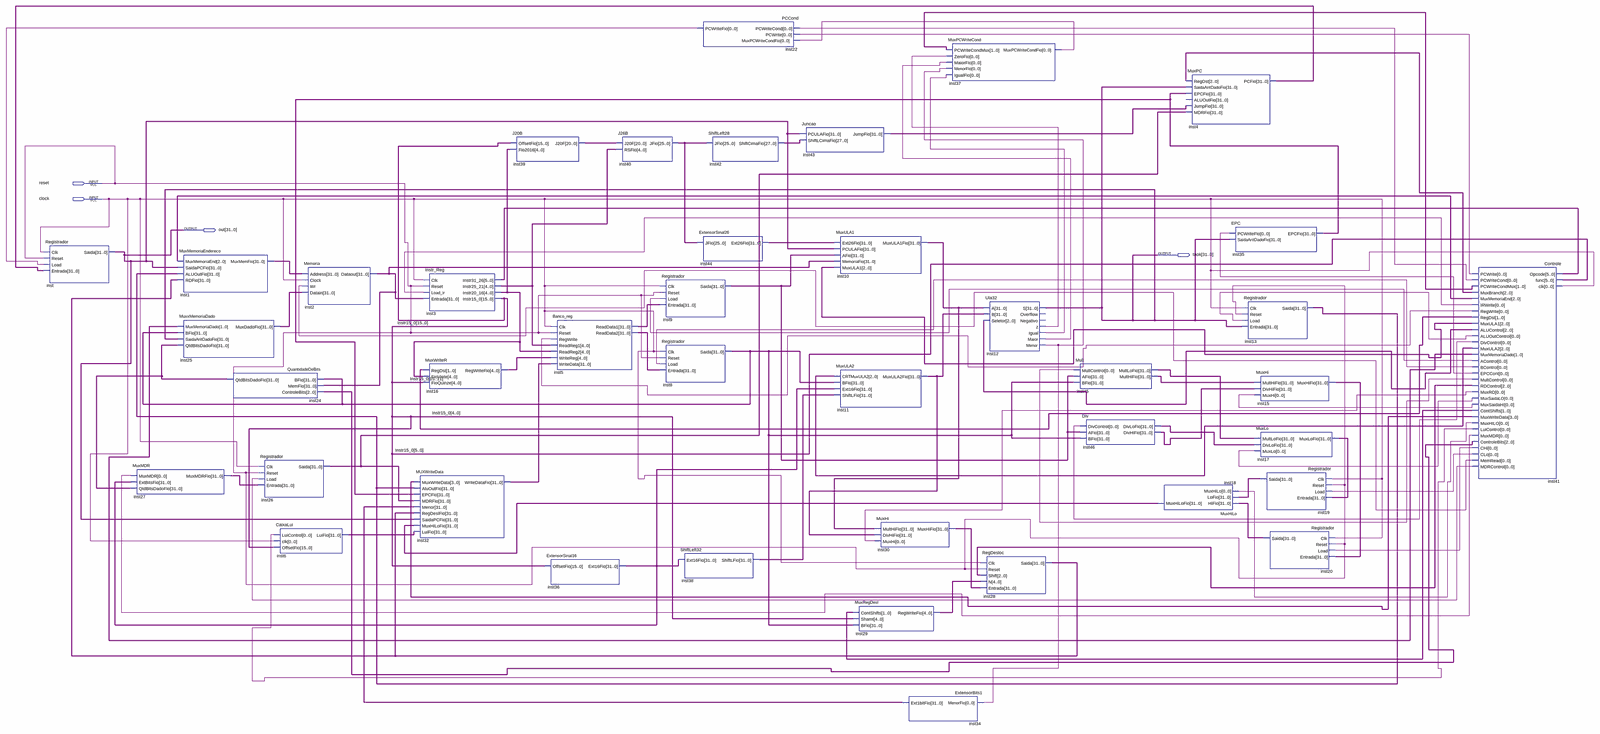
[diagram p0: schematic sheet, whole]
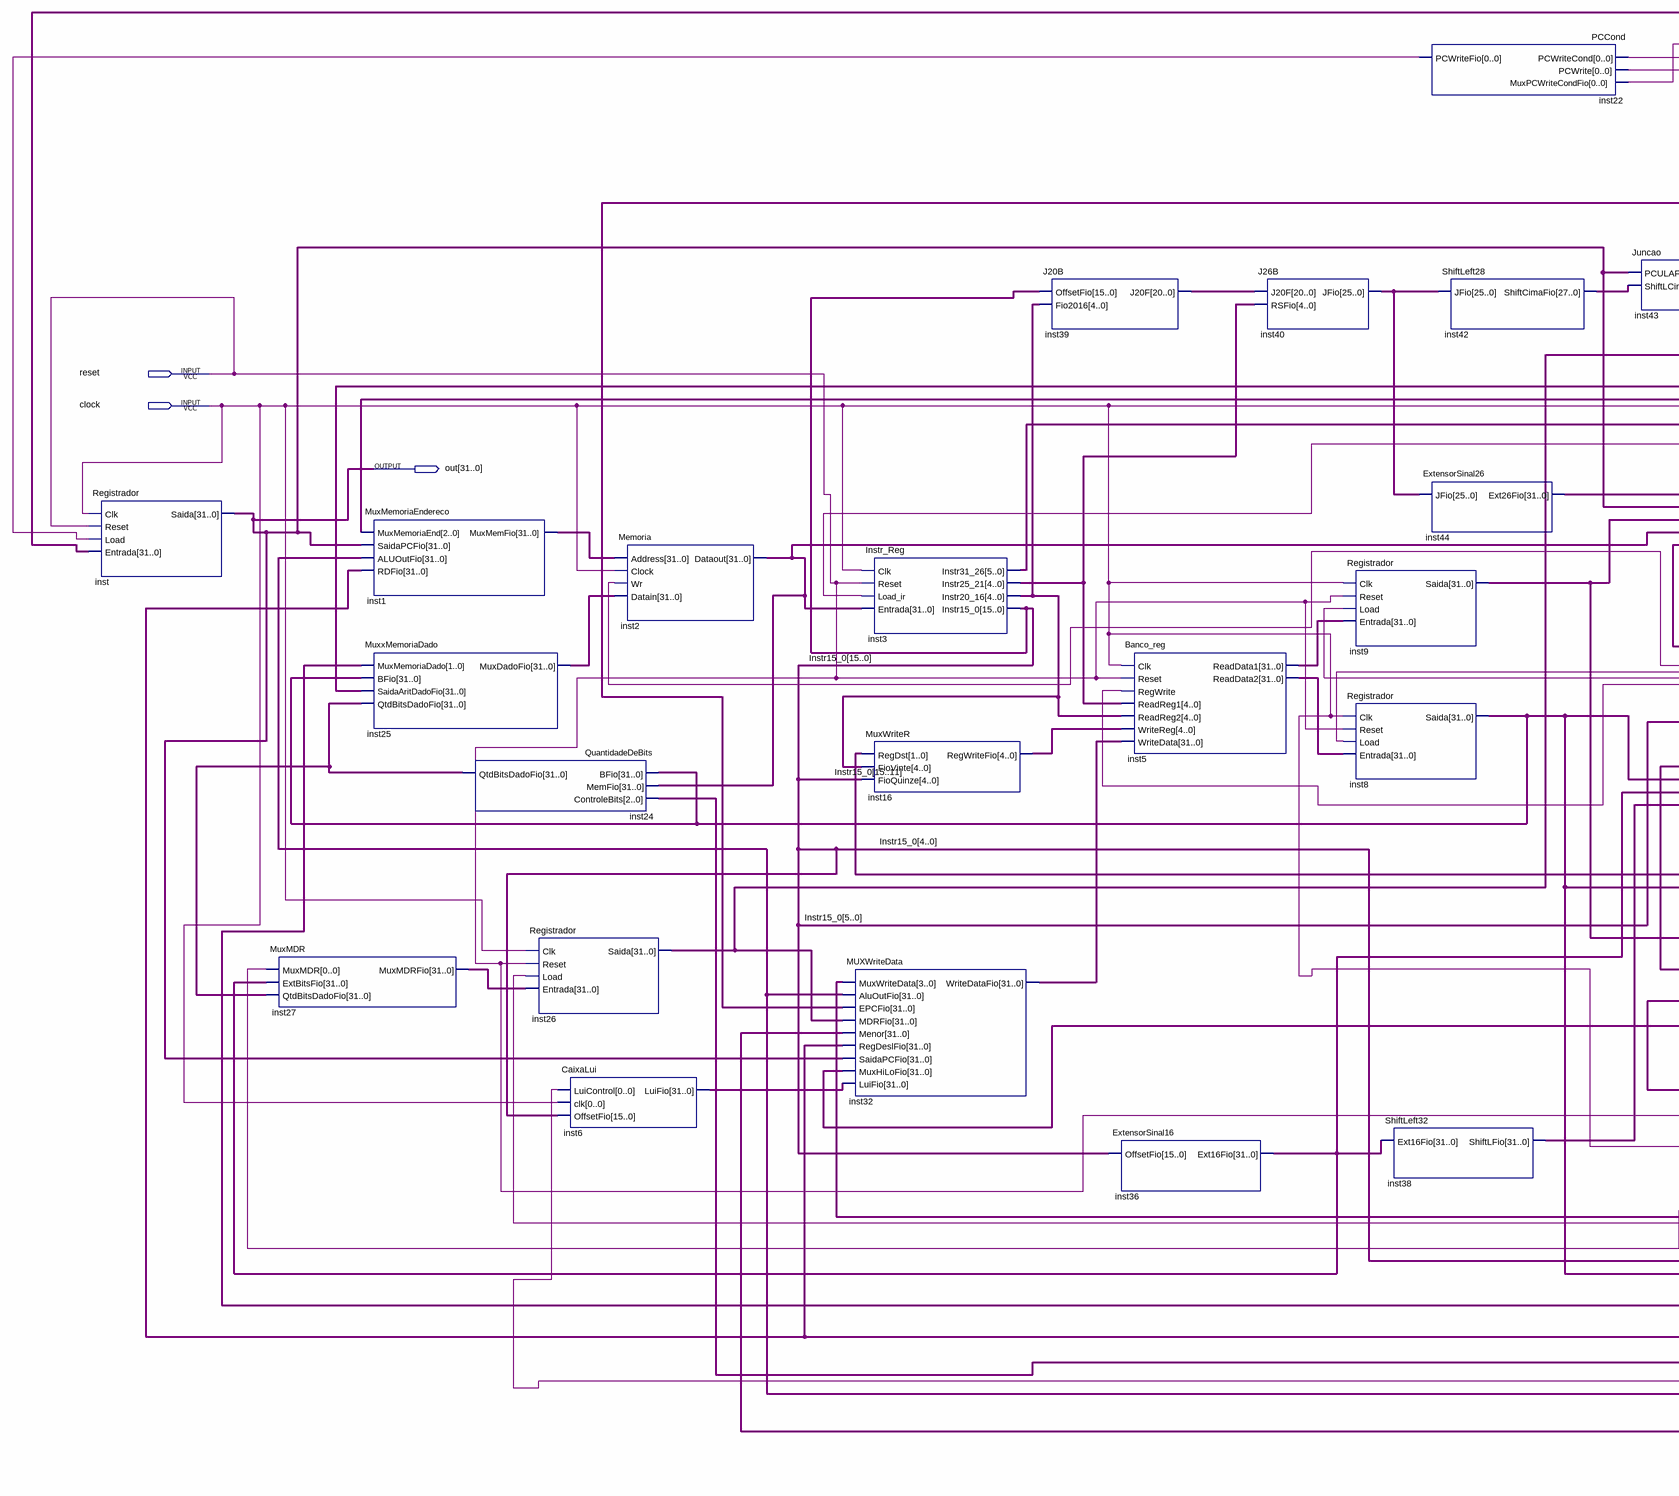
[diagram p1: schematic sheet, left part]
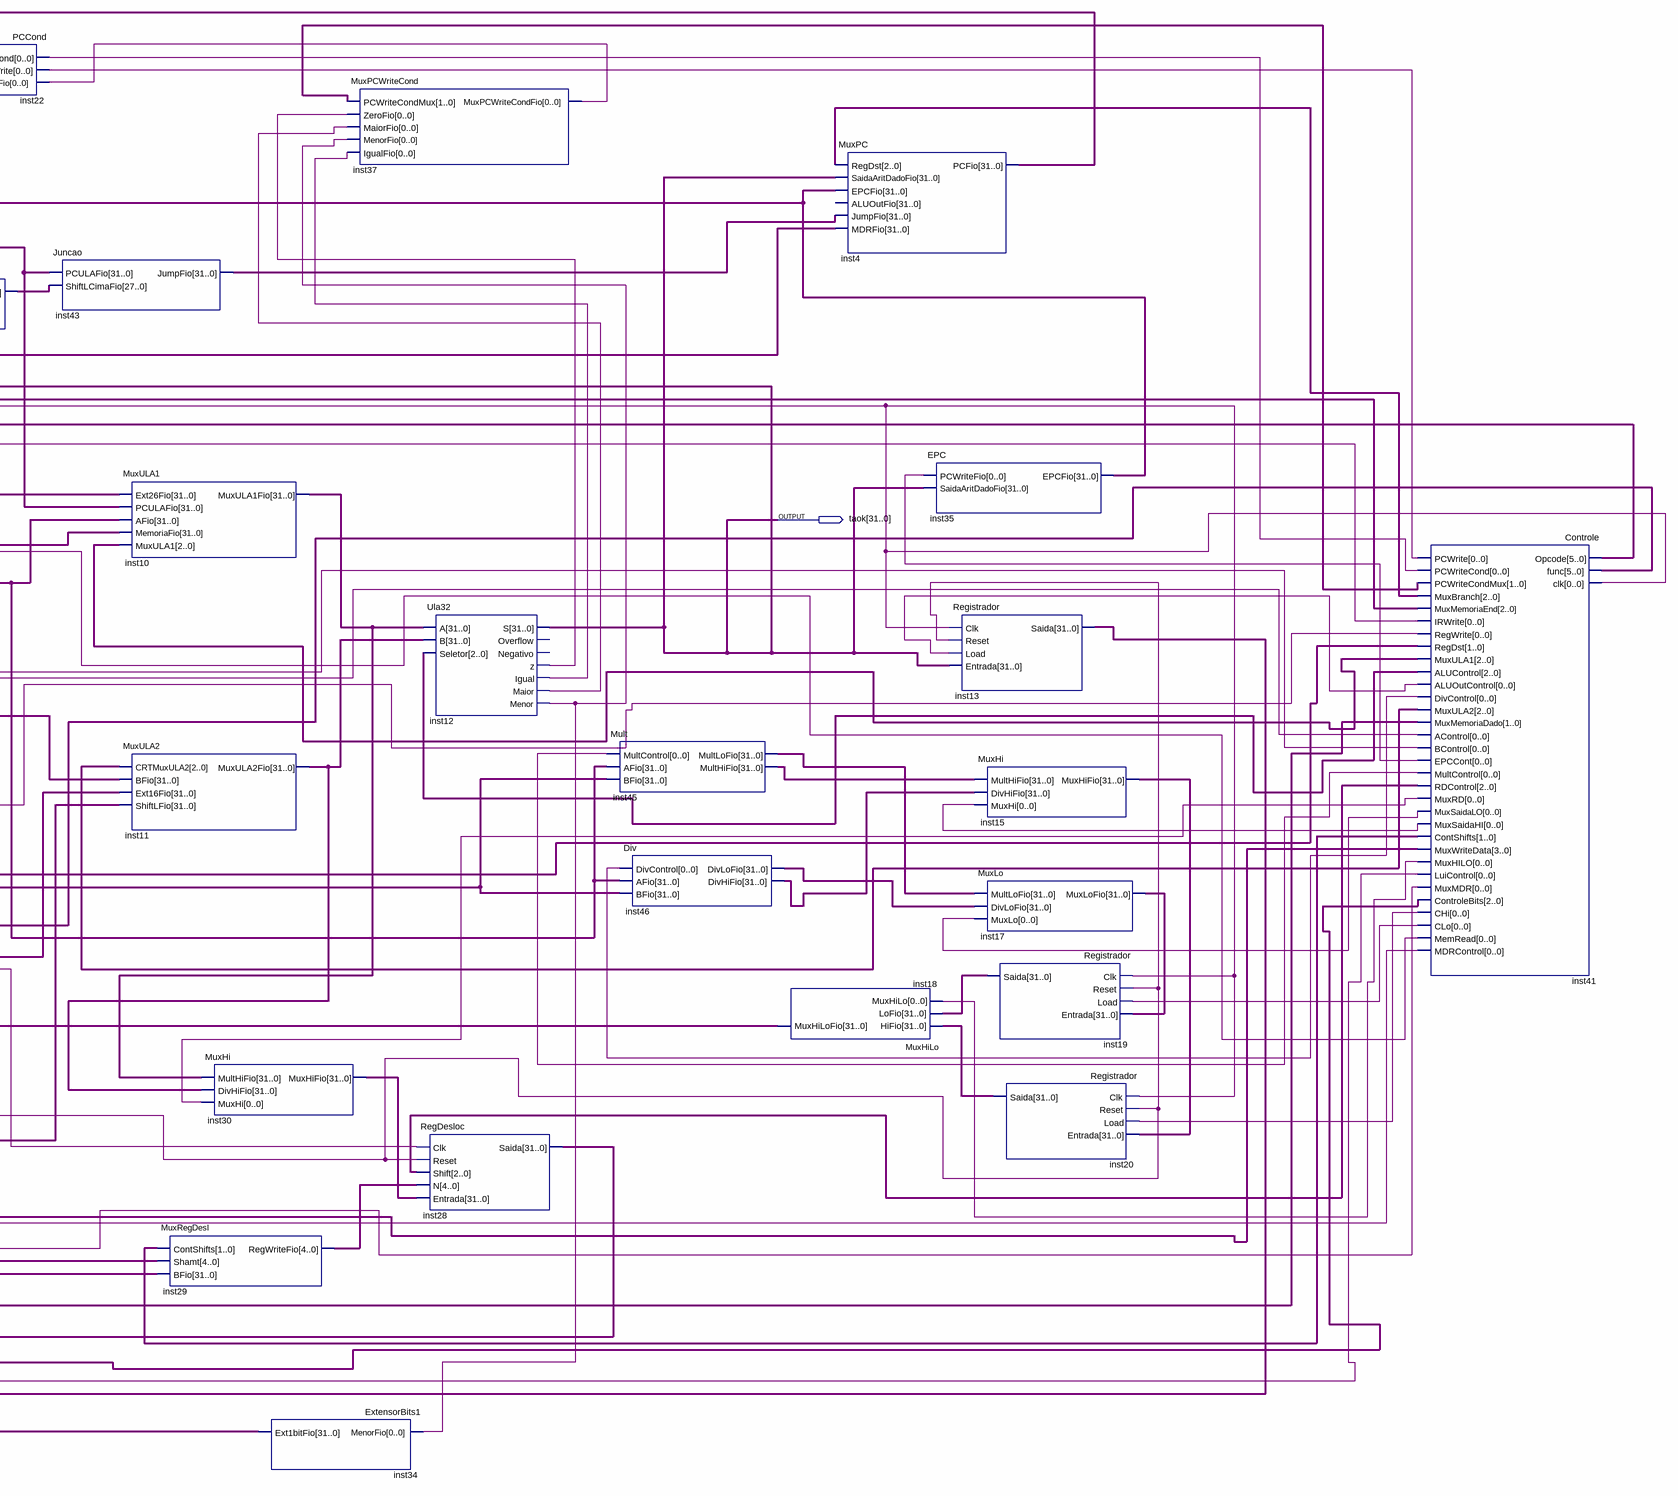
[diagram p2: schematic sheet, right part]
// Quartus schematic CPU.bdf as structural Verilog: 41 symbols, 4 pins
module CPU (
  input  reset,
  input  clock,
  output [31:0] out,
  output [31:0] taok
);

  wire inst12_igual, inst12_maior, inst12_menor, inst12_z, inst22_pcwritefio, inst37_muxpcwritecondfio,
       inst41_acontrol, inst41_aluoutcontrol, inst41_bcontrol, inst41_chi, inst41_clo, inst41_divcontrol,
       inst41_epccont, inst41_irwrite, inst41_luicontrol, inst41_mdrcontrol, inst41_memread,
       inst41_multcontrol, inst41_muxhilo, inst41_muxmdr, inst41_muxrd, inst41_muxsaidahi, inst41_muxsaidalo,
       inst41_pcwrite, inst41_pcwritecond, inst41_regwrite;
  wire [1:0] inst41_contshifts, inst41_muxmemoriadado, inst41_pcwritecondmux, inst41_regdst;
  wire [2:0] inst41_alucontrol, inst41_controlebits, inst41_muxbranch, inst41_muxmemoriaend, inst41_muxula1,
       inst41_muxula2, inst41_rdcontrol;
  wire [3:0] inst41_muxwritedata;
  wire [4:0] inst3_instr20_16, inst3_instr25_21, inst16_regwritefio, inst29_regwritefio;
  wire [5:0] inst3_instr31_26;
  wire [15:0] Instr15_0;
  wire [20:0] inst39_j20f;
  wire [25:0] inst40_jfio;
  wire [27:0] inst42_shiftcimafio;
  wire [31:0] inst1_muxmemfio, inst2_dataout, inst4_pcfio, inst5_readdata1, inst5_readdata2, inst6_luifio,
       inst8_saida, inst9_saida, inst10_muxula1fio, inst11_muxula2fio, inst13_saida, inst15_muxhifio,
       inst17_muxlofio, inst18_muxhilofio, inst19_saida, inst20_saida, inst24_qtdbitsdadofio,
       inst25_muxdadofio, inst26_saida, inst27_muxmdrfio, inst28_saida, inst30_muxhifio, inst32_writedatafio,
       inst34_ext1bitfio, inst35_epcfio, inst36_ext16fio, inst38_shiftlfio, inst43_jumpfio, inst44_ext26fio,
       inst45_multhifio, inst45_multlofio, inst46_divhifio, inst46_divlofio;

  Registrador inst (.Clk(clock), .Reset(reset), .Load(inst22_pcwritefio), .Entrada(inst4_pcfio), .Saida(out));
  MuxMDR inst27 (
    .MuxMDR(inst41_muxmdr), .ExtBitsFio(inst36_ext16fio), .QtdBitsDadoFio(inst24_qtdbitsdadofio),
    .MuxMDRFio(inst27_muxmdrfio));
  MuxMemoriaEndereco inst1 (
    .MuxMemoriaEnd(inst41_muxmemoriaend), .SaidaPCFio(out), .ALUOutFio(inst13_saida), .RDFio(inst28_saida),
    .MuxMemFio(inst1_muxmemfio));
  MuxxMemoriaDado inst25 (
    .MuxMemoriaDado(inst41_muxmemoriadado), .BFio(inst8_saida), .SaidaAritDadoFio(taok),
    .QtdBitsDadoFio(inst24_qtdbitsdadofio), .MuxDadoFio(inst25_muxdadofio));
  QuantidadeDeBits inst24 (
    .BFio(inst8_saida), .MemFio(inst2_dataout), .ControleBits(inst41_controlebits),
    .QtdBitsDadoFio(inst24_qtdbitsdadofio));
  Registrador inst26 (
    .Clk(clock), .Reset(reset), .Load(inst41_mdrcontrol), .Entrada(inst27_muxmdrfio), .Saida(inst26_saida));
  CaixaLui inst6 (.LuiControl(inst41_luicontrol), .clk(clock), .OffsetFio(Instr15_0), .LuiFio(inst6_luifio));
  Memoria inst2 (
    .Address(inst1_muxmemfio), .Clock(clock), .Wr(inst41_memread), .Datain(inst25_muxdadofio),
    .Dataout(inst2_dataout));
  Instr_Reg inst3 (
    .Clk(clock), .Reset(reset), .Load_ir(inst41_irwrite), .Entrada(inst2_dataout),
    .Instr31_26(inst3_instr31_26), .Instr25_21(inst3_instr25_21), .Instr20_16(inst3_instr20_16),
    .Instr15_0(Instr15_0));
  MuxWriteR inst16 (
    .RegDst(inst41_regdst), .FioVinte(inst3_instr20_16), .FioQuinze(Instr15_0[15:11]),
    .RegWriteFio(inst16_regwritefio));
  MUXWriteData inst32 (
    .MuxWriteData(inst41_muxwritedata), .AluOutFio(inst13_saida), .EPCFio(inst35_epcfio),
    .MDRFio(inst26_saida), .Menor(inst34_ext1bitfio), .RegDeslFio(inst28_saida), .SaidaPCFio(out),
    .MuxHiLoFio(inst18_muxhilofio), .LuiFio(inst6_luifio), .WriteDataFio(inst32_writedatafio));
  J20B inst39 (.OffsetFio(Instr15_0), .Fio2016(inst3_instr20_16), .J20F(inst39_j20f));
  ExtensorSinal16 inst36 (.OffsetFio(Instr15_0), .Ext16Fio(inst36_ext16fio));
  Banco_reg inst5 (
    .Clk(clock), .Reset(reset), .RegWrite(inst41_regwrite), .ReadReg1(inst3_instr25_21),
    .ReadReg2(inst3_instr20_16), .WriteReg(inst16_regwritefio), .WriteData(inst32_writedatafio),
    .ReadData1(inst5_readdata1), .ReadData2(inst5_readdata2));
  J26B inst40 (.J20F(inst39_j20f), .RSFio(inst3_instr25_21), .JFio(inst40_jfio));
  Registrador inst9 (
    .Clk(clock), .Reset(reset), .Load(inst41_acontrol), .Entrada(inst5_readdata1), .Saida(inst9_saida));
  Registrador inst8 (
    .Clk(clock), .Reset(reset), .Load(inst41_bcontrol), .Entrada(inst5_readdata2), .Saida(inst8_saida));
  PCCond inst22 (
    .PCWriteCond(inst41_pcwritecond), .PCWrite(inst41_pcwrite), .MuxPCWriteCondFio(inst37_muxpcwritecondfio),
    .PCWriteFio(inst22_pcwritefio));
  ExtensorSinal26 inst44 (.JFio(inst40_jfio), .Ext26Fio(inst44_ext26fio));
  ShiftLeft32 inst38 (.Ext16Fio(inst36_ext16fio), .ShiftLFio(inst38_shiftlfio));
  ShiftLeft28 inst42 (.JFio(inst40_jfio), .ShiftCimaFio(inst42_shiftcimafio));
  Juncao inst43 (.PCULAFio(out), .ShiftLCimaFio(inst42_shiftcimafio), .JumpFio(inst43_jumpfio));
  MuxULA1 inst10 (
    .Ext26Fio(inst44_ext26fio), .PCULAFio(out), .AFio(inst9_saida), .MemoriaFio(inst2_dataout),
    .MuxULA1(inst41_muxula1), .MuxULA1Fio(inst10_muxula1fio));
  MuxULA2 inst11 (
    .CRTMuxULA2(inst41_muxula2), .BFio(inst8_saida), .Ext16Fio(inst36_ext16fio),
    .ShiftLFio(inst38_shiftlfio), .MuxULA2Fio(inst11_muxula2fio));
  MuxRegDesl inst29 (
    .ContShifts(inst41_contshifts), .Shamt(Instr15_0[4:0]), .BFio(inst8_saida),
    .RegWriteFio(inst29_regwritefio));
  MuxHi inst30 (
    .MultHiFio(inst10_muxula1fio), .DivHiFio(inst11_muxula2fio), .MuxHi(inst41_muxrd),
    .MuxHiFio(inst30_muxhifio));
  ExtensorBits1 inst34 (.MenorFio(inst12_menor), .Ext1bitFio(inst34_ext1bitfio));
  MuxPCWriteCond inst37 (
    .PCWriteCondMux(inst41_pcwritecondmux), .ZeroFio(inst12_z), .MaiorFio(inst12_maior),
    .MenorFio(inst12_menor), .IgualFio(inst12_igual), .MuxPCWriteCondFio(inst37_muxpcwritecondfio));
  Ula32 inst12 (
    .A(inst10_muxula1fio), .B(inst11_muxula2fio), .Seletor(inst41_alucontrol), .S(taok), .z(inst12_z),
    .Igual(inst12_igual), .Maior(inst12_maior), .Menor(inst12_menor));  // open: Overflow, Negativo
  RegDesloc inst28 (
    .Clk(clock), .Reset(reset), .Shift(inst41_rdcontrol), .N(inst29_regwritefio), .Entrada(inst30_muxhifio),
    .Saida(inst28_saida));
  Mult inst45 (
    .MultControl(inst41_multcontrol), .AFio(inst9_saida), .BFio(inst8_saida), .MultLoFio(inst45_multlofio),
    .MultHiFio(inst45_multhifio));
  Div inst46 (
    .DivControl(inst41_divcontrol), .AFio(inst9_saida), .BFio(inst8_saida), .DivLoFio(inst46_divlofio),
    .DivHiFio(inst46_divhifio));
  MuxHiLo inst18 (.HiFio(inst20_saida), .LoFio(inst19_saida), .MuxHiLo(inst41_muxhilo), .MuxHiLoFio(inst18_muxhilofio));
  MuxPC inst4 (
    .RegDst(inst41_muxbranch), .SaidaAritDadoFio(taok), .EPCFio(inst35_epcfio), .JumpFio(inst43_jumpfio),
    .MDRFio(inst26_saida), .PCFio(inst4_pcfio));  // open: ALUOutFio
  EPC inst35 (.PCWriteFio(inst41_epccont), .SaidaAritDadoFio(taok), .EPCFio(inst35_epcfio));
  Registrador inst13 (.Clk(clock), .Reset(reset), .Load(inst41_aluoutcontrol), .Entrada(taok), .Saida(inst13_saida));
  MuxHi inst15 (
    .MultHiFio(inst45_multhifio), .DivHiFio(inst46_divhifio), .MuxHi(inst41_muxsaidahi),
    .MuxHiFio(inst15_muxhifio));
  MuxLo inst17 (
    .MultLoFio(inst45_multlofio), .DivLoFio(inst46_divlofio), .MuxLo(inst41_muxsaidalo),
    .MuxLoFio(inst17_muxlofio));
  Registrador inst19 (.Clk(clock), .Reset(reset), .Load(inst41_clo), .Entrada(inst17_muxlofio), .Saida(inst19_saida));
  Registrador inst20 (.Clk(clock), .Reset(reset), .Load(inst41_chi), .Entrada(inst15_muxhifio), .Saida(inst20_saida));
  Controle inst41 (
    .Opcode(inst3_instr31_26), .func(Instr15_0[5:0]), .clk(clock), .PCWrite(inst41_pcwrite),
    .PCWriteCond(inst41_pcwritecond), .PCWriteCondMux(inst41_pcwritecondmux), .MuxBranch(inst41_muxbranch),
    .MuxMemoriaEnd(inst41_muxmemoriaend), .IRWrite(inst41_irwrite), .RegWrite(inst41_regwrite),
    .RegDst(inst41_regdst), .MuxULA1(inst41_muxula1), .ALUControl(inst41_alucontrol),
    .ALUOutControl(inst41_aluoutcontrol), .DivControl(inst41_divcontrol), .MuxULA2(inst41_muxula2),
    .MuxMemoriaDado(inst41_muxmemoriadado), .AControl(inst41_acontrol), .BControl(inst41_bcontrol),
    .EPCCont(inst41_epccont), .MultControl(inst41_multcontrol), .RDControl(inst41_rdcontrol),
    .MuxRD(inst41_muxrd), .MuxSaidaLO(inst41_muxsaidalo), .MuxSaidaHI(inst41_muxsaidahi),
    .ContShifts(inst41_contshifts), .MuxWriteData(inst41_muxwritedata), .MuxHILO(inst41_muxhilo),
    .LuiControl(inst41_luicontrol), .MuxMDR(inst41_muxmdr), .ControleBits(inst41_controlebits),
    .CHi(inst41_chi), .CLo(inst41_clo), .MemRead(inst41_memread), .MDRControl(inst41_mdrcontrol));
endmodule
